# EAGLE schematic revA-voltlog-mod (EAGLE 9.6.2)

## Sheet 1 of 3
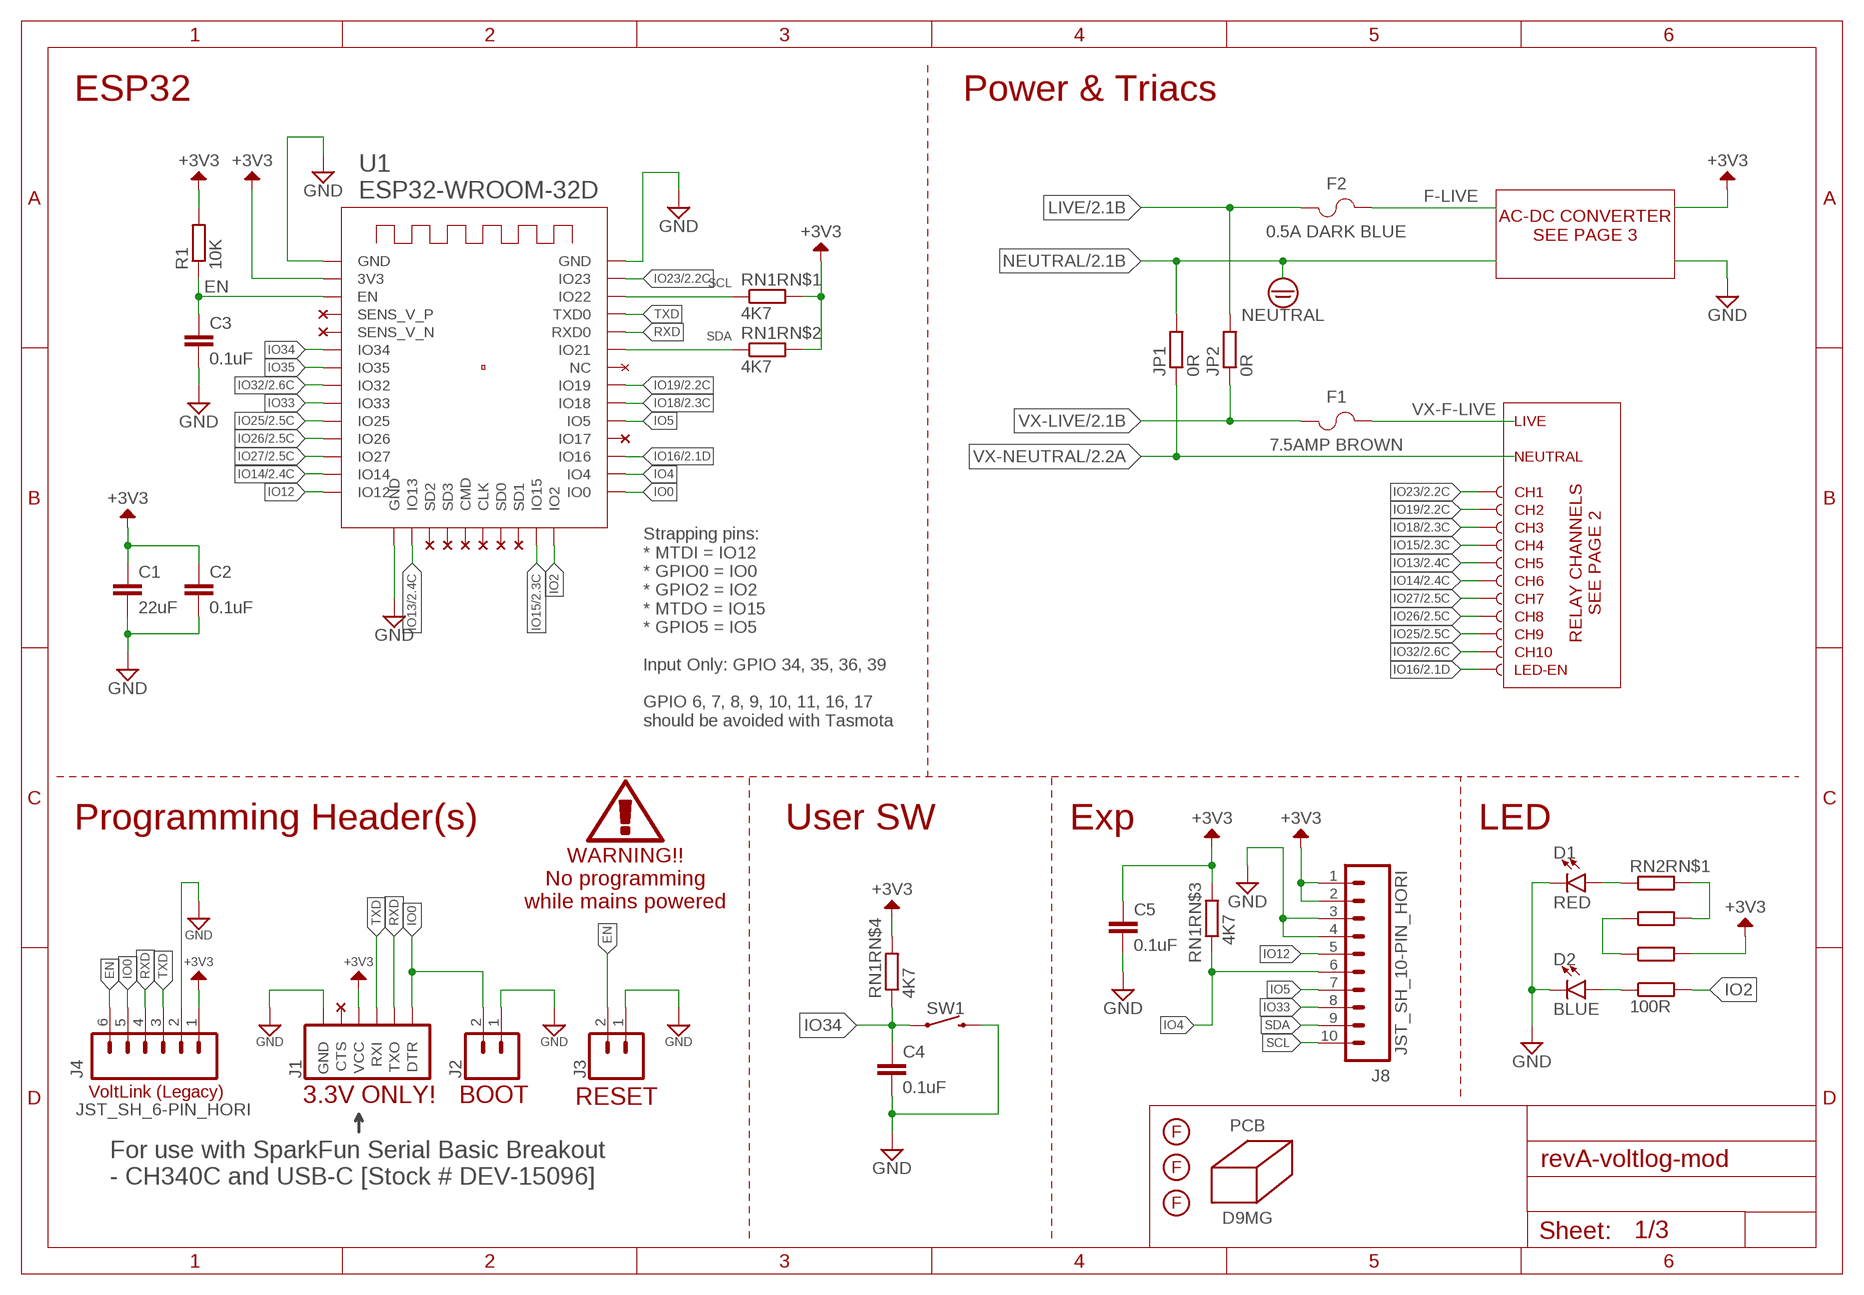
[diagram p0: schematic, sheet 1]

### Parts
C1  22uF  C-EUC0603  [C0603]
C2  0.1uF  C-EUC0603  [C0603]
C3  0.1uF  C-EUC0603  [C0603]
C4  0.1uF  C-EUC0603  [C0603]
C5  0.1uF  C-EUC0603  [C0603]
CH2  TEST-POINT3X4  [PAD.03X.04]
D1  RED  LED-RED-0805  [LED-0805]
D2  BLUE  LED-GREEN0805-PG  [LED-0805]
F1  7.5AMP BROWN  FUSEMINI-TH  [FUSE-MINI-THI]
F2  0.5A DARK BLUE  FUSEMINI-TH  [FUSE-MINI-THI]
IO13  TEST-POINT3X4  [PAD.03X.04]
J1  6_PIN_SERIAL_TARGETSILK  [6_PIN_SERIAL_TARGET_SIDE_W_SILK]
J2  CONN_02  [1X02]
J3  CONN_02  [1X02]
J4  JST_SH_6-PIN_HORI  [JST-SH-6-SMD-HORI-1.0MM]
J8  JST_SH_10-PIN_HORI  [JST-SH-10-SMD-HORI-1.0MM]
JP1  0R  R-EU_R1210  [R1210]
JP2  0R  R-EU_R1210  [R1210]
PCB  D9MG  [D9MG-160X90X50]
R1  10K  R-EU_R0603  [R0603]
RN1  4K7  R-EU-41206  [R1206X4]
RN2  100R  R-EU-41206  [R1206X4]
SW1  MOMENTARY-SWITCH-SPST-SMD-5.2-TALL-REDUNDANT  [TACTILE_SWITCH_SMD_5.2MM]
TP1  TEST-POINT3X4  [PAD.03X.04]
TP3  TEST-POINT3X4  [PAD.03X.04]
TP4  TEST-POINT3X4  [PAD.03X.04]
TP6  TEST-POINT3X4  [PAD.03X.04]
TP7  TEST-POINT3X4  [PAD.03X.04]
TP8  TEST-POINT3X4  [PAD.03X.04]
TP9  TEST-POINT3X4  [PAD.03X.04]
TP10  TEST-POINT3X4  [PAD.03X.04]
TP11  TEST-POINT3X4  [PAD.03X.04]
U1  ESP32-WROOM-32D  [ESP32-WROOM-32_EXP]
U$2  FIDUCIAL  [FIDUCIAL]
U$3  FIDUCIAL  [FIDUCIAL]
U$4  FIDUCIAL  [FIDUCIAL]

### Nets
+3V3: C1.1 C2.1 C5.1 J1.4(VCC) J4.1 J8.1 J8.2 R1.2 RN1.5 RN1.6 RN1.7 RN1.8 RN2.6 U1.2(3V3) ; also sheet 2,3
EN: C3.1 J3.2 J4.6 R1.1 U1.3(EN)
F-LIVE: F2.2@1 F2.2@2
GND: C1.2 C2.2 C3.2 C4.2 C5.2 D1.C D2.C J1.6(GND) J2.1 J3.1 J4.2 J8.3 J8.4 SW1.3 SW1.4 U1.1(GND) U1.15(GND) U1.38(GND) U1.39@1(GND) U1.39@2(GND) U1.39@3(GND) U1.39@4(GND) U1.39@5(GND) U1.39@6(GND) U1.39@7(GND) U1.39@8(GND) U1.39@9(GND) ; also sheet 2,3
IO0: J1.1(DTR) J2.2 J4.5 U1.25(IO0)
IO2: RN2.5 U1.24(IO2)
IO4: J8.6 RN1.3 U1.26(IO4)
IO5: J8.7 U1.29(IO5)
IO12: J8.5 U1.14(IO12)
IO13: IO13.1 U1.16(IO13) ; also sheet 2
IO14: TP6.1 U1.13(IO14) ; also sheet 2
IO15: TP4.1 U1.23(IO15) ; also sheet 2
IO16: TP11.1 U1.27(IO16) ; also sheet 2
IO18: TP3.1 U1.30(IO18) ; also sheet 2
IO19: CH2.1 U1.31(IO19) ; also sheet 2
IO23: TP1.1 U1.37(IO23) ; also sheet 2
IO25: TP9.1 U1.10(IO25) ; also sheet 2
IO26: TP8.1 U1.11(IO26) ; also sheet 2
IO27: TP7.1 U1.12(IO27) ; also sheet 2
IO32: TP10.1 U1.8(IO32) ; also sheet 2
IO33: J8.8 U1.9(IO33)
IO34: C4.1 RN1.4 SW1.1 SW1.2 U1.6(IO34)
IO35: U1.7(IO35)
LIVE: F2.1@1 F2.1@2 JP2.2 ; also sheet 2,3
N$27: RN2.2 RN2.3
N$28: D2.A RN2.4
N$29: RN2.7 RN2.8
N$30: D1.A RN2.1
NEUTRAL: JP1.2 ; also sheet 2,3
RXD: J1.2(TXO) J4.4 U1.34(RXD0)
SCL: J8.10 RN1.1 U1.36(IO22)
SDA: J8.9 RN1.2 U1.33(IO21)
TXD: J1.3(RXI) J4.3 U1.35(TXD0)
VX-F-LIVE: F1.2@1 F1.2@2 ; also sheet 2
VX-LIVE: F1.1@1 F1.1@2 JP2.1 ; also sheet 2
VX-NEUTRAL: JP1.1 ; also sheet 2
Unconnected: J1.5(CTS) J4.M@1(M) J4.M@2(M) J8.M@1(M) J8.M@2(M) U1.4(SENS_V_P) U1.5(SENS_V_N) U1.17(SD2) U1.18(SD3) U1.19(CMD) U1.20(CLK) U1.21(SD0) U1.22(SD1) U1.28(IO17) U1.32(NC)

### Notes on the sheet
- ESP32 | Power & Triacs
- AC-DC CONVERTER
  SEE PAGE 3
- LIVE
- NEUTRAL
- CH1
- CH2
- Strapping pins:
  * MTDI = IO12
  * GPIO0 = IO0
  * GPIO2 = IO2
  * MTDO = IO15
  * GPIO5 = IO5
  
  Input Only: GPIO 34, 35, 36, 39
  
  GPIO 6, 7, 8, 9, 10, 11, 16, 17
  should be avoided with Tasmota
- CH3
- CH4
- CH5
- RELAY CHANNELS
  SEE PAGE 2
- CH6
- CH7
- CH8
- CH9
- CH10
- LED-EN
- Programming Header(s) | User SW | Exp | LED
- WARNING!!
  No programming
  while mains powered
- VoltLink (Legacy) | 3.3V ONLY! | BOOT | RESET
- For use with SparkFun Serial Basic Breakout
  - CH340C and USB-C [Stock # DEV-15096]

## Sheet 2 of 3
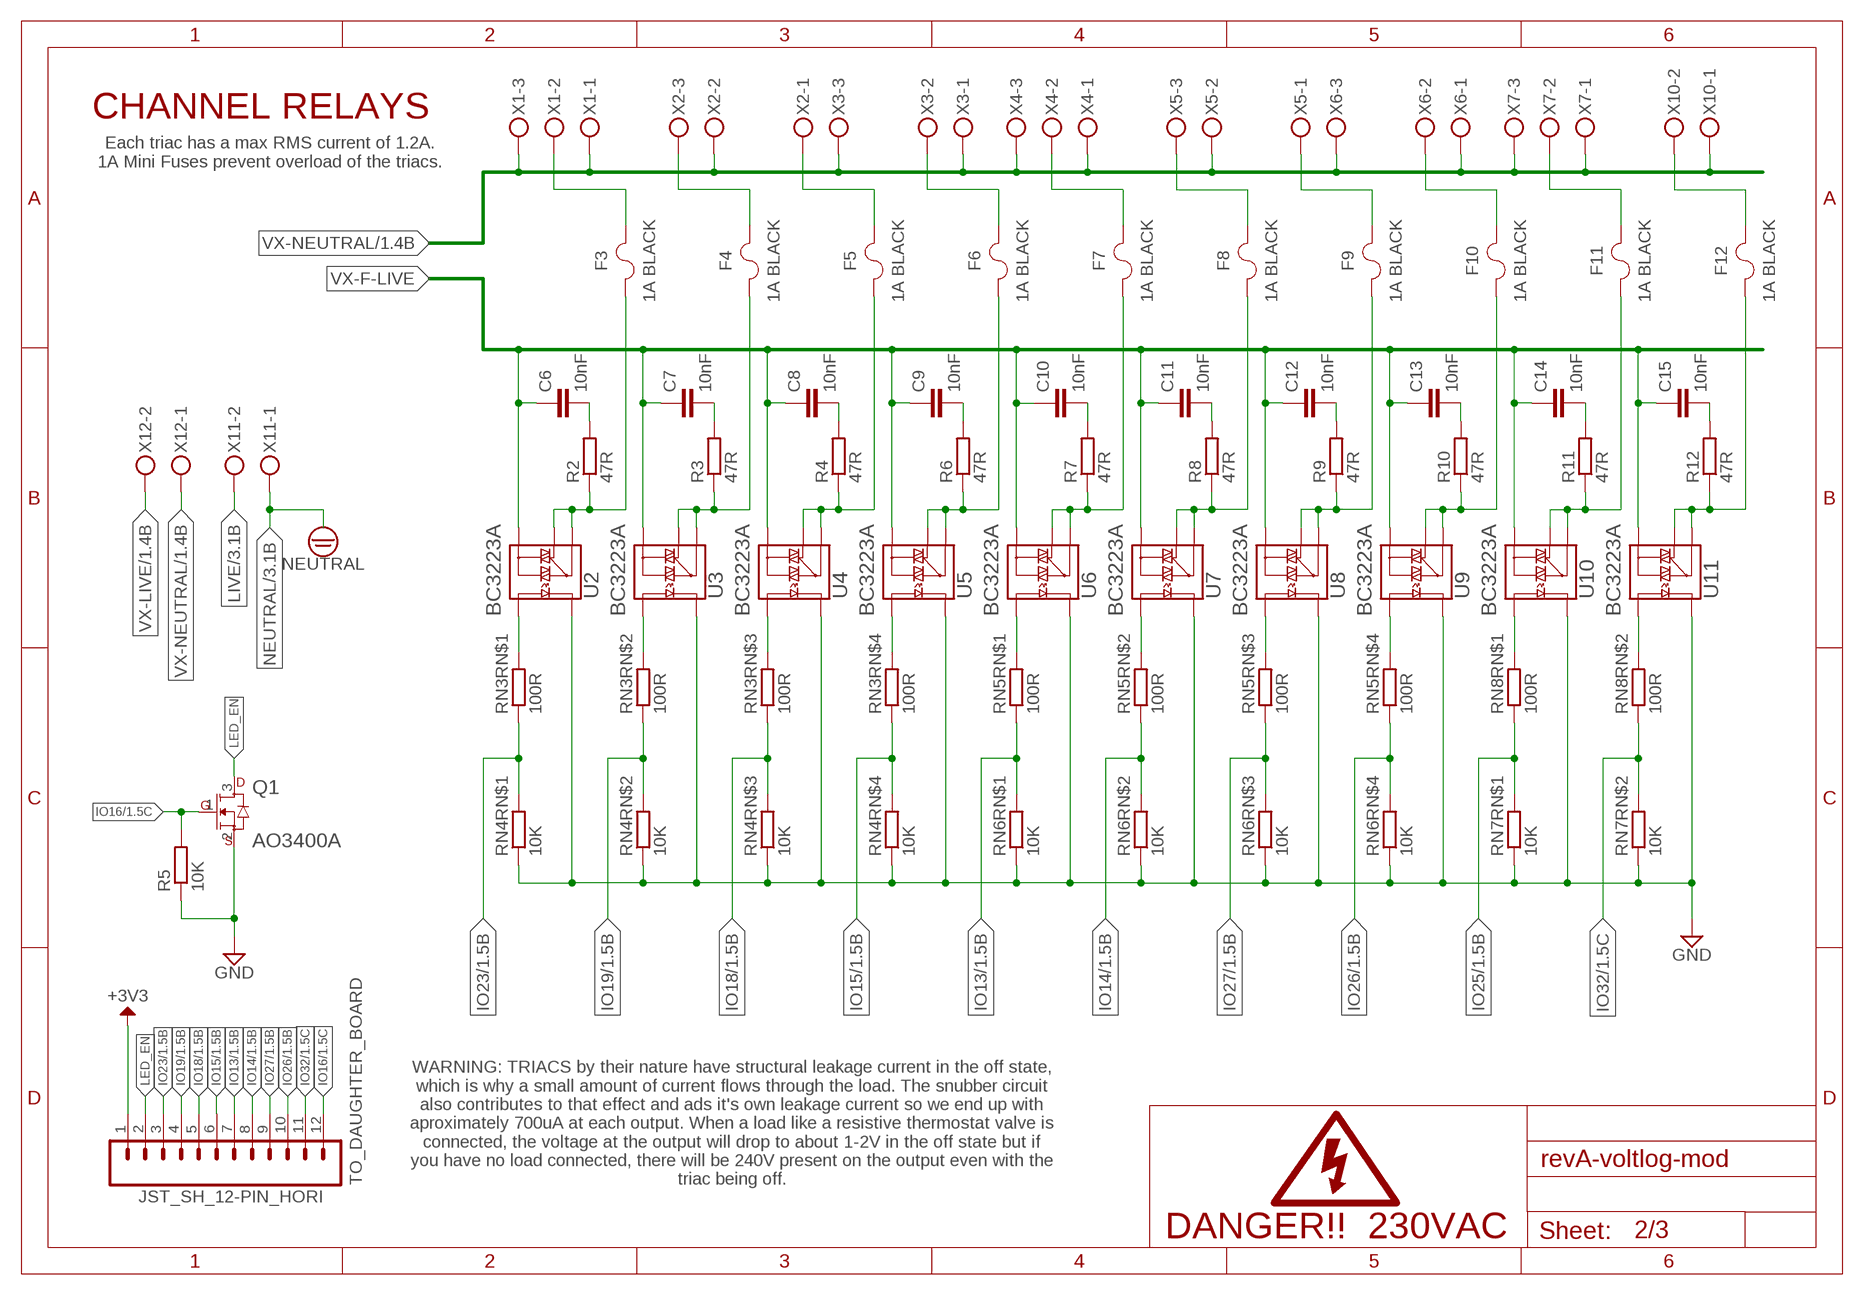
[diagram p1: schematic, sheet 2]

### Parts
C6  10nF  C-EU050-045X075  [C050-045X075]
C7  10nF  C-EU050-045X075  [C050-045X075]
C8  10nF  C-EU050-045X075  [C050-045X075]
C9  10nF  C-EU050-045X075  [C050-045X075]
C10  10nF  C-EU050-045X075  [C050-045X075]
C11  10nF  C-EU050-045X075  [C050-045X075]
C12  10nF  C-EU050-045X075  [C050-045X075]
C13  10nF  C-EU050-045X075  [C050-045X075]
C14  10nF  C-EU050-045X075  [C050-045X075]
C15  10nF  C-EU050-045X075  [C050-045X075]
F3  1A BLACK  FUSEMINI-TH  [FUSE-MINI-THI]
F4  1A BLACK  FUSEMINI-TH  [FUSE-MINI-THI]
F5  1A BLACK  FUSEMINI-TH  [FUSE-MINI-THI]
F6  1A BLACK  FUSEMINI-TH  [FUSE-MINI-THI]
F7  1A BLACK  FUSEMINI-TH  [FUSE-MINI-THI]
F8  1A BLACK  FUSEMINI-TH  [FUSE-MINI-THI]
F9  1A BLACK  FUSEMINI-TH  [FUSE-MINI-THI]
F10  1A BLACK  FUSEMINI-TH  [FUSE-MINI-THI]
F11  1A BLACK  FUSEMINI-TH  [FUSE-MINI-THI]
F12  1A BLACK  FUSEMINI-TH  [FUSE-MINI-THI]
Q1  AO3400A  [SOT-23-3L_AOS]
R2  47R  R-EU_R1206W  [R1206W]
R3  47R  R-EU_R1206W  [R1206W]
R4  47R  R-EU_R1206W  [R1206W]
R5  10K  R-EU_R0603  [R0603]
R6  47R  R-EU_R1206W  [R1206W]
R7  47R  R-EU_R1206W  [R1206W]
R8  47R  R-EU_R1206W  [R1206W]
R9  47R  R-EU_R1206W  [R1206W]
R10  47R  R-EU_R1206W  [R1206W]
R11  47R  R-EU_R1206W  [R1206W]
R12  47R  R-EU_R1206W  [R1206W]
RN3  100R  R-EU-41206  [R1206X4]
RN4  10K  R-EU-41206  [R1206X4]
RN5  100R  R-EU-41206  [R1206X4]
RN6  10K  R-EU-41206  [R1206X4]
RN7  10K  R-EU-41206  [R1206X4]
RN8  100R  R-EU-41206  [R1206X4]
TO_DAUGHTER_BOARD  JST_SH_12-PIN_HORI  [JST-SH-12-SMD-HORI-1.0MM]
U2  BC3223A  BCX2X3A  [7-PIN_DUAL-DIP-SMD]
U3  BC3223A  BCX2X3A  [7-PIN_DUAL-DIP-SMD]
U4  BC3223A  BCX2X3A  [7-PIN_DUAL-DIP-SMD]
U5  BC3223A  BCX2X3A  [7-PIN_DUAL-DIP-SMD]
U6  BC3223A  BCX2X3A  [7-PIN_DUAL-DIP-SMD]
U7  BC3223A  BCX2X3A  [7-PIN_DUAL-DIP-SMD]
U8  BC3223A  BCX2X3A  [7-PIN_DUAL-DIP-SMD]
U9  BC3223A  BCX2X3A  [7-PIN_DUAL-DIP-SMD]
U10  BC3223A  BCX2X3A  [7-PIN_DUAL-DIP-SMD]
U11  BC3223A  BCX2X3A  [7-PIN_DUAL-DIP-SMD]
X1  MKDSN1,5/3-5,08  [MKDSN1,5/3-5,08]
X2  MKDSN1,5/3-5,08  [MKDSN1,5/3-5,08]
X3  MKDSN1,5/3-5,08  [MKDSN1,5/3-5,08]
X4  MKDSN1,5/3-5,08  [MKDSN1,5/3-5,08]
X5  MKDSN1,5/3-5,08  [MKDSN1,5/3-5,08]
X6  MKDSN1,5/3-5,08  [MKDSN1,5/3-5,08]
X7  MKDSN1,5/3-5,08  [MKDSN1,5/3-5,08]
X10  MKDSN1,5/2-5,08  [MKDSN1,5/2-5,08]
X11  MKDSN1,5/2-5,08  [MKDSN1,5/2-5,08]
X12  MKDSN1,5/2-5,08  [MKDSN1,5/2-5,08]

### Nets
+3V3: TO_DAUGHTER_BOARD.1 ; also sheet 1,3
GND: Q1.2(S) R5.1 RN4.1 RN4.2 RN4.3 RN4.4 RN6.1 RN6.2 RN6.3 RN6.4 RN7.1 RN7.2 U2.1@1(C) U2.1@2(C) U2.3@1(C) U2.3@2(C) U2.4@1(C) U2.4@2(C) U3.1@1(C) U3.1@2(C) U3.3@1(C) U3.3@2(C) U3.4@1(C) U3.4@2(C) U4.1@1(C) U4.1@2(C) U4.3@1(C) U4.3@2(C) U4.4@1(C) U4.4@2(C) U5.1@1(C) U5.1@2(C) U5.3@1(C) U5.3@2(C) U5.4@1(C) U5.4@2(C) U6.1@1(C) U6.1@2(C) U6.3@1(C) U6.3@2(C) U6.4@1(C) U6.4@2(C) U7.1@1(C) U7.1@2(C) U7.3@1(C) U7.3@2(C) U7.4@1(C) U7.4@2(C) U8.1@1(C) U8.1@2(C) U8.3@1(C) U8.3@2(C) U8.4@1(C) U8.4@2(C) U9.1@1(C) U9.1@2(C) U9.3@1(C) U9.3@2(C) U9.4@1(C) U9.4@2(C) U10.1@1(C) U10.1@2(C) U10.3@1(C) U10.3@2(C) U10.4@1(C) U10.4@2(C) U11.1@1(C) U11.1@2(C) U11.3@1(C) U11.3@2(C) U11.4@1(C) U11.4@2(C) ; also sheet 1,3
IO13: RN5.1 RN6.8 TO_DAUGHTER_BOARD.7 ; also sheet 1
IO14: RN5.2 RN6.7 TO_DAUGHTER_BOARD.8 ; also sheet 1
IO15: RN3.4 RN4.5 TO_DAUGHTER_BOARD.6 ; also sheet 1
IO16: Q1.1(G) R5.2 TO_DAUGHTER_BOARD.12 ; also sheet 1
IO18: RN3.3 RN4.6 TO_DAUGHTER_BOARD.5 ; also sheet 1
IO19: RN3.2 RN4.7 TO_DAUGHTER_BOARD.4 ; also sheet 1
IO23: RN3.1 RN4.8 TO_DAUGHTER_BOARD.3 ; also sheet 1
IO25: RN7.8 RN8.1 ; also sheet 1
IO26: RN5.4 RN6.5 TO_DAUGHTER_BOARD.10 ; also sheet 1
IO27: RN5.3 RN6.6 TO_DAUGHTER_BOARD.9 ; also sheet 1
IO32: RN7.7 RN8.2 TO_DAUGHTER_BOARD.11 ; also sheet 1
LED_EN: Q1.3(D) TO_DAUGHTER_BOARD.2
LIVE: X11.2 ; also sheet 1,3
N$1: F3.1@1 F3.1@2 R2.1 U2.5@1(L3) U2.5@2(L3) U2.6@1(L2) U2.6@2(L2)
N$2: F4.1@1 F4.1@2 R3.1 U3.5@1(L3) U3.5@2(L3) U3.6@1(L2) U3.6@2(L2)
N$3: F6.1@1 F6.1@2 R6.1 U5.5@1(L3) U5.5@2(L3) U5.6@1(L2) U5.6@2(L2)
N$4: F5.1@1 F5.1@2 R4.1 U4.5@1(L3) U4.5@2(L3) U4.6@1(L2) U4.6@2(L2)
N$5: F7.1@1 F7.1@2 R7.1 U6.5@1(L3) U6.5@2(L3) U6.6@1(L2) U6.6@2(L2)
N$6: F8.1@1 F8.1@2 R8.1 U7.5@1(L3) U7.5@2(L3) U7.6@1(L2) U7.6@2(L2)
N$7: F9.1@1 F9.1@2 R9.1 U8.5@1(L3) U8.5@2(L3) U8.6@1(L2) U8.6@2(L2)
N$8: F11.1@1 F11.1@2 R11.1 U10.5@1(L3) U10.5@2(L3) U10.6@1(L2) U10.6@2(L2)
N$9: F10.1@1 F10.1@2 R10.1 U9.5@1(L3) U9.5@2(L3) U9.6@1(L2) U9.6@2(L2)
N$10: C6.2 R2.2
N$11: C7.2 R3.2
N$12: C8.2 R4.2
N$13: C9.2 R6.2
N$14: C10.2 R7.2
N$15: RN3.6 U4.2@1(A) U4.2@2(A)
N$17: C11.2 R8.2
N$18: RN3.5 U5.2@1(A) U5.2@2(A)
N$19: C12.2 R9.2
N$21: C13.2 R10.2
N$22: C14.2 R11.2
N$23: RN5.8 U6.2@1(A) U6.2@2(A)
N$24: F12.1@1 F12.1@2 R12.1 U11.5@1(L3) U11.5@2(L3) U11.6@1(L2) U11.6@2(L2)
N$25: C15.2 R12.2
N$26: RN8.7 U11.2@1(A) U11.2@2(A)
N$31: F3.2@1 F3.2@2 X1.2
N$32: F4.2@1 F4.2@2 X2.3
N$33: F5.2@1 F5.2@2 X2.1
N$34: F6.2@1 F6.2@2 X3.2
N$35: F7.2@1 F7.2@2 X4.2
N$36: F8.2@1 F8.2@2 X5.3
N$37: F9.2@1 F9.2@2 X5.1
N$38: F10.2@1 F10.2@2 X6.2
N$39: F11.2@1 F11.2@2 X7.2
N$40: F12.2@1 F12.2@2 X10.2
N$41: RN3.8 U2.2@1(A) U2.2@2(A)
N$43: RN3.7 U3.2@1(A) U3.2@2(A)
N$45: RN8.8 U10.2@1(A) U10.2@2(A)
N$46: RN5.5 U9.2@1(A) U9.2@2(A)
N$47: RN5.6 U8.2@1(A) U8.2@2(A)
N$48: RN5.7 U7.2@1(A) U7.2@2(A)
NEUTRAL: X11.1 ; also sheet 1,3
VX-F-LIVE: C6.1 C7.1 C8.1 C9.1 C10.1 C11.1 C12.1 C13.1 C14.1 C15.1 U2.8@1(L1) U2.8@2(L1) U3.8@1(L1) U3.8@2(L1) U4.8@1(L1) U4.8@2(L1) U5.8@1(L1) U5.8@2(L1) U6.8@1(L1) U6.8@2(L1) U7.8@1(L1) U7.8@2(L1) U8.8@1(L1) U8.8@2(L1) U9.8@1(L1) U9.8@2(L1) U10.8@1(L1) U10.8@2(L1) U11.8@1(L1) U11.8@2(L1) ; also sheet 1
VX-LIVE: X12.2 ; also sheet 1
VX-NEUTRAL: X1.1 X1.3 X2.2 X3.1 X3.3 X4.1 X4.3 X5.2 X6.1 X6.3 X7.1 X7.3 X10.1 X12.1 ; also sheet 1
Unconnected: RN7.3 RN7.4 RN7.5 RN7.6 RN8.3 RN8.4 RN8.5 RN8.6 TO_DAUGHTER_BOARD.M@1(M) TO_DAUGHTER_BOARD.M@2(M)

### Notes on the sheet
- CHANNEL RELAYS
- Each triac has a max RMS current of 1.2A.
  1A Mini Fuses prevent overload of the triacs.
- WARNING: TRIACS by their nature have structural leakage current in the off state,
  which is why a small amount of current flows through the load. The snubber circuit
  also contributes to that effect and ads it's own leakage current so we end up with
  aproximately 700uA at each output. When a load like a resistive thermostat valve is
  connected, the voltage at the output will drop to about 1-2V in the off state but if
  you have no load connected, there will be 240V present on the output even with the
  triac being off.
- DANGER!!  230VAC

## Sheet 3 of 3
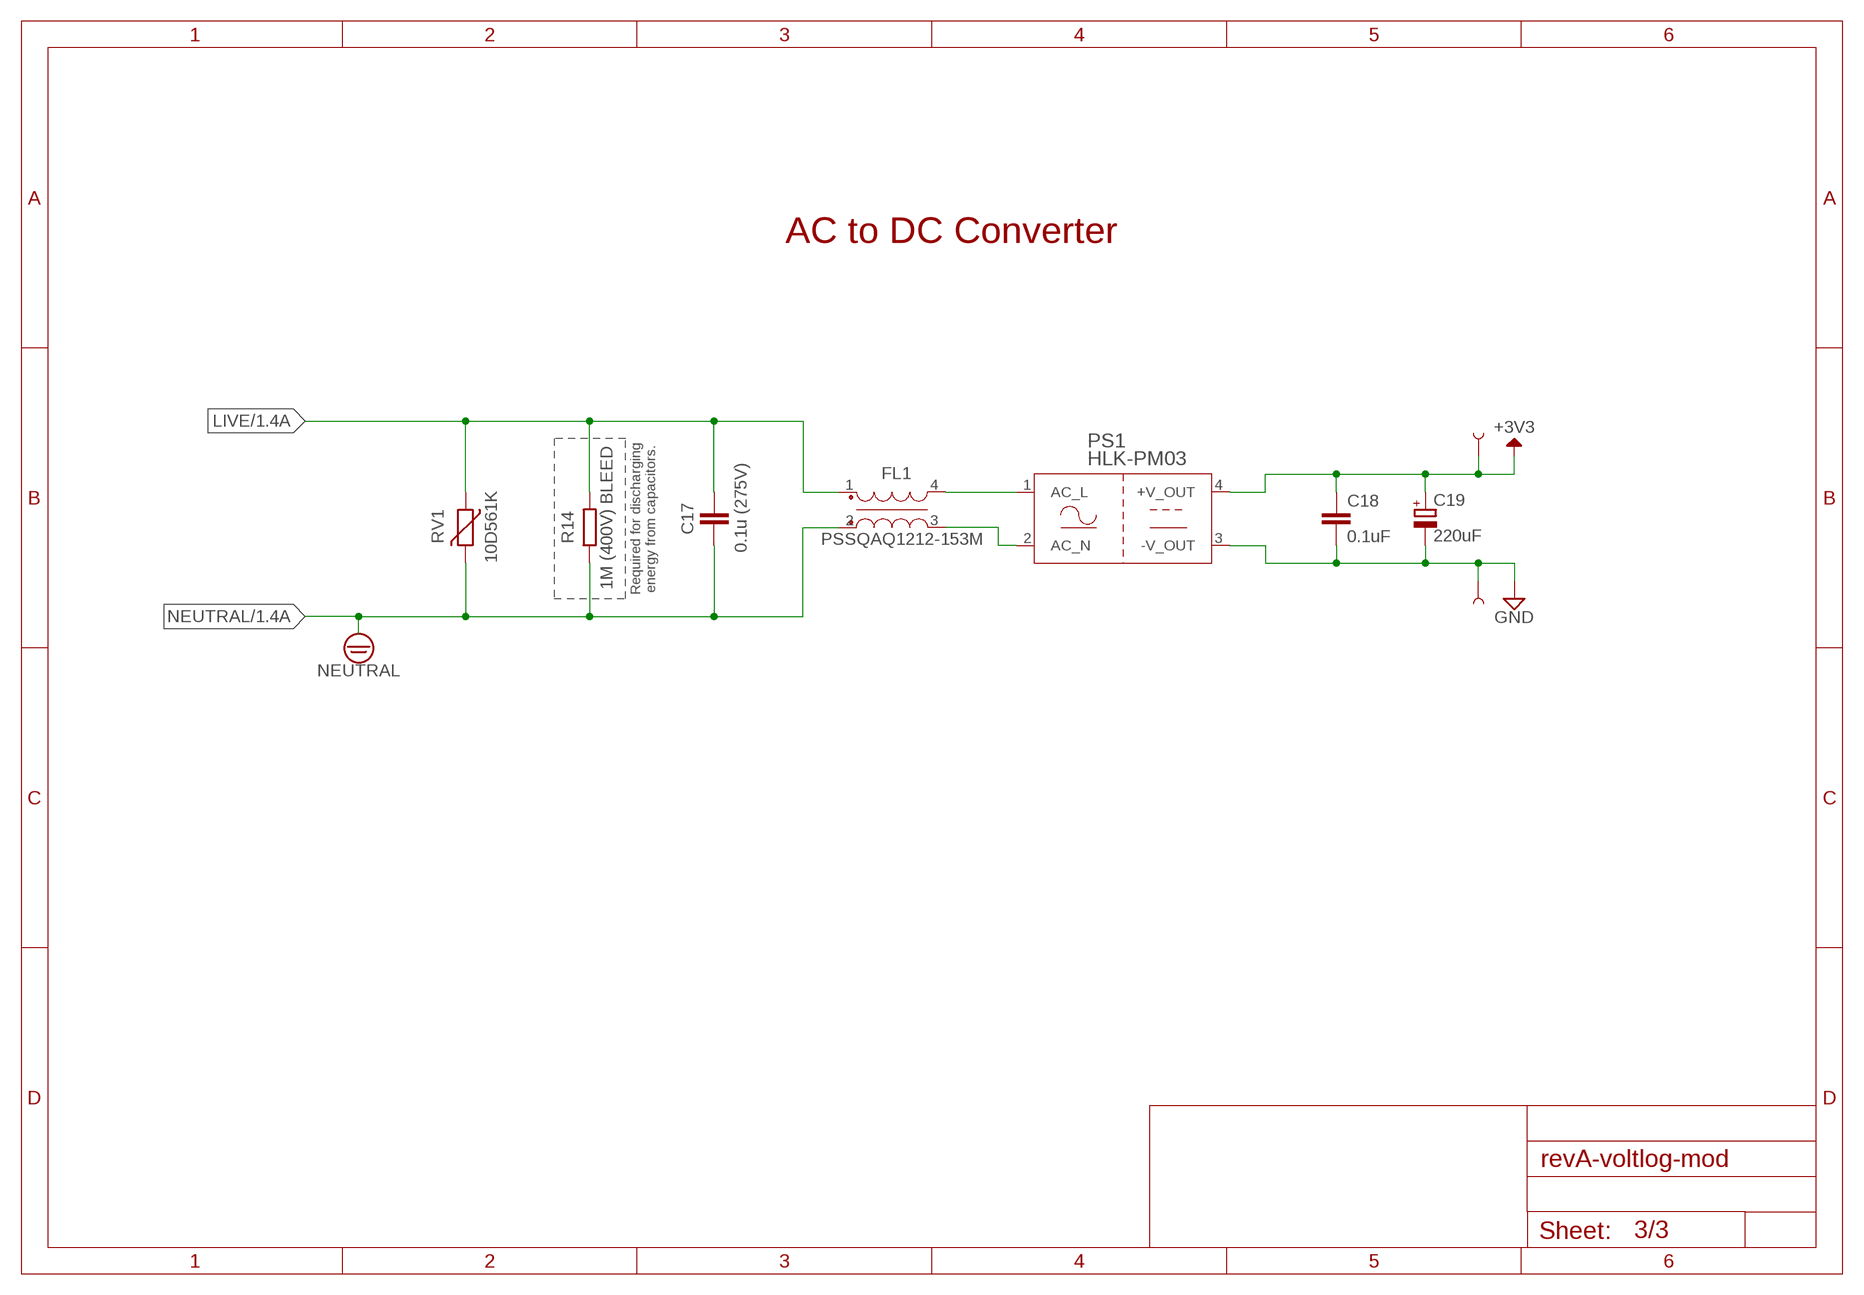
[diagram p2: schematic, sheet 3]

### Parts
C17  0.1u (275V)  C-EU075-063X106  [C075-063X106]
C18  0.1uF  C-EUC1206  [C1206]
C19  220uF  CPOL-EUUD-6,3X7,7  [UD-6,3X7,7_NICHICON]
FL1  PSSQAQ1212-153M  PSSQAQ1212  [CHOKE-SMD-20X17MM]
PS1  HLK-PM03  [DIP4_HLK-PM_HLK]
R14  1M (400V) BLEED  R-EU_R2010W  [R2010W]
RV1  10D561K  VARISTOR-7,5  [R-7,5]
TP2  TEST-POINT3X5  [PAD.03X.05]
TP5  TEST-POINT3X5  [PAD.03X.05]

### Nets
+3V3: C18.1 C19.+ PS1.4(+V_OUT) TP2.1 ; also sheet 1,2
GND: C18.2 C19.- PS1.3(-V_OUT) TP5.1 ; also sheet 1,2
LIVE: C17.2 FL1.1 R14.2 RV1.1 ; also sheet 1,2
N$16: FL1.4 PS1.1(AC_L)
N$20: FL1.3 PS1.2(AC_N)
NEUTRAL: C17.1 FL1.2 R14.1 RV1.2 ; also sheet 1,2

### Notes on the sheet
- AC to DC Converter
- Required for discharging
  energy from capacitors.

## Library data of the parts
C1-C15 C17 C18 = rcl:C-EU: CAPACITOR, European symbol; SPICEPREFIX: C
C19 = rcl:CPOL-EU: POLARIZED CAPACITOR, European symbol; SPICEPREFIX: C
CH2 IO13 TP1-TP11 = SparkFun-Connectors:TEST-POINT: SparkFun Test Points Bare copper test points for troubleshooting or In-Circuit-Testing. These are used by our Production team for verifying production board runs using pogo-pins on test beds. SparkFun Products: SparkFun LSM9DS1 Breakout <https://www.sparkfun.com/products/13284> SparkFun PSOC <https://www.sparkfun.com/products/13714> SparkFun Load Cell Amplifier <https://www.sparkfun.com/products/13879>
D1 = SparkFun-LED:LED-RED: Red SMD LED Used in manufacturing of most products at SparkFun Packages: 0603 - KB - KingBright (DIO-17976) SMD 0603 package [Datasheet] <https://www.kingbrightusa.com/images/catalog/SPEC/APT1608SURCK.pdf> 0603 - (DIO-00819, has gone EOL) SMD 0603 package 0603 SMART - SMD 0603 SMART package ( more efficient and expensive)[Product Link] <http://www.osram-os.com/Graphics/XPic2/00077099_0.pdf> 1206 - SMD1206 package [Product Link] <https://www.sparkfun.com/datasheets/DevTools/LilyPad/Q150OVS4.pdff> SparkFun Products: Pro Mini 328 -5V <https://www.sparkfun.com/products/821> RedBoard <https://www.sparkfun.com/products/12757> IOIO-OTG <https://www.sparkfun.com/products/13613>; PROD_ID: DIO-16865
D2 = SparkFun-LED:LED-GREEN: Green SMD LED Used in manufacturing of various products at SparkFun Packages: 0603 - SMD 0603 package [Product Link] <http://www.futureelectronics.com/en/technologies/semiconductors/optoelectronics/leds/Pages/9894312-LTST-C190GKT.aspx?CrossPart=HSMG-C190&IM=0> LilyPad 1206 - SMD1206 LilyPad package [Product Link] <http://www.futureelectronics.com/en/Technologies/Product.aspx?ProductID=IN150NGHARVATEKCORPORATION2049943&IM=0> 1206 - SMD1206 package [Product Link] <http://www.futureelectronics.com/en/technologies/semiconductors/optoelectronics/leds/Pages/8315665-LTST-C150KGKT.aspx?IM=0> 1206 Bottom Mount -SMD 1206 Bottom Mount [Product Link] <http://www.digikey.com/product-detail/en/lite-on-inc/LTST-C230KGKT/160-1456-1-ND/386854> SparkFun Products: Pro Mini 328 -5V <https://www.sparkfun.com/products/821> RedBoard <https://www.sparkfun.com/products/12757> MP3 Trigger <https://www.sparkfun.com/products/13720> Makey Makey <https://www.sparkfun.com/products/11076>
F1-F12 = amu-parts:FUSE
FL1 = untitled:PSSQAQ1212
J1 = SparkFun-Connectors:6_PIN_SERIAL_TARGET: 6-pin header connection for use with the "FTDI BASIC" pinout - TARGET SIDE. Also known as "Arduino Serial Program Header". It is used to mate with our FTDI Basic serial programmers using the Arduino IDE. Note, this device has "TARGET" in the name. It is intended to be used on a design that contains a target micro-controller that you wish to program. The "sister" device, named "CABLE" is inteneded to be used on a design that usually lives on the end of your USB cable and prvides the converter chip (FTDI232 or FTDI231x) to commnicate serial RX/TX. You can populate with some of these: Break Away Headers - Straight <https://www.sparkfun.com/products/116> (PRT-00116) For reference (or to suit your programming needs) check out these designs: SparkFun FTDI Basic Breakout - 5V <https://www.sparkfun.com/products/9716> (DEV-09716) SparkFun FTDI Basic Breakout - 3.3V <https://www.sparkfun.com/products/9873> (DEV-09873) SparkFun FTDI SmartBasic <https://www.sparkfun.com/products/12935> (DEV-12935) SparkFun Beefy 3 - FTDI Basic Breakout <https://www.sparkfun.com/products/13746> (DEV-13746)
J2 J3 = SparkFun-Connectors:CONN_02: Multi connection point. Often used as Generic Header-pin footprint for 0.1 inch spaced/style header connections On any of the 0.1 inch spaced packages, you can populate with these: Break Away Headers - Straight <https://www.sparkfun.com/products/116> (PRT-00116) Break Away Male Headers - Right Angle <https://www.sparkfun.com/products/553> (PRT-00553) Female Headers <https://www.sparkfun.com/products/115> (PRT-00115) Break Away Headers - Machine Pin <https://www.sparkfun.com/products/117> (PRT-00117) Break Away Female Headers - Swiss Machine Pin <https://www.sparkfun.com/products/743> (PRT-00743) For SCREWTERMINALS and SPRING TERMINALS visit here: Screw Terimnals on SparkFun.com <https://www.sparkfun.com/search/results?term=Screw+Terminals> (5mm/3.5mm/2.54mm spacing) This device is also useful as a general connection point to wire up your design to another part of your project. Our various solder wires solder well into these plated through hole pads. Hook-Up Wire - Assortment (Stranded, 22 AWG) <https://www.sparkfun.com/products/11375> (PRT-11375) Hook-Up Wire - Assortment (Solid Core, 22 AWG) <https://www.sparkfun.com/products/11367> (PRT-11367) View the entire wire category on our website here <https://www.sparkfun.com/categories/141> Special notes: Molex polarized connector foot print use with: PRT-08233 with associated crimp pins and housings. 2.54_SCREWTERM for use with PRT-10571. 3.5mm Screw Terminal footprints for PRT-08084 5mm Screw Terminal footprints for use with PRT-08432
J4 = untitled:JST_SH_6-PIN_HORI
J8 = tecsmith-jst:JST_SH_10-PIN_HORI
JP1 JP2 R1-R12 R14 = rcl:R-EU_: RESISTOR, European symbol; SPICEPREFIX: R
PCB = tecsmith_ali_plastic_enclosures:D9MG
PS1 = amu-parts:HLK-PM03; MANUFACTURER_PART_NUMBER: HLK-PM03; MFR_NAME: Hi-Link
Q1 = untitled:AO3400A
RN1-RN8 = tecsmith_keyboards:R-EU-4
RV1 = varistor:VARISTOR: VARISTOR
SW1 = SparkFun-Switches:MOMENTARY-SWITCH-SPST: Momentary Switch (Pushbutton) - SPST Normally-open (NO) SPST momentary switches (buttons, pushbuttons). Variants PTH-12MM - 12mm square, through-hole Momentary Pushbutton Switch - 12mm Square <https://www.sparkfun.com/products/9190> (COM-09190) PTH-6.0MM, PTH-6.0MM-KIT - 6.0mm square, through-hole Mini Pushbutton Switch <https://www.sparkfun.com/products/97> (COM-00097) KIT package intended for soldering kit's - only one side of pads' copper is exposed. PTH-RIGHT-ANGLE-KIT - Right-angle, through-hole Right Angle Tactile Button <https://www.sparkfun.com/products/10791> - Used on SparkFun BigTime Watch Kit <https://www.sparkfun.com/products/11734> SMD-12MM - 12mm square, surface-mount Tactile Button - SMD (12mm) <https://www.sparkfun.com/products/12993> (COM-12993) Used on SparkFun PicoBoard <https://www.sparkfun.com/products/11888> SMD-4.5MM - 4.5mm Square Trackball Switch Used on SparkFun Blackberry Trackballer Breakout <https://www.sparkfun.com/products/13169> SMD-4.6MMX2.8MM - 4.60mm x 2.80mm, surface mount Used on SparkFun Pro Micro - RP2040 <https://www.sparkfun.com/products/17717> SMD-5.2MM, SMD-5.2-REDUNDANT - 5.2mm square, surface-mount Mini Pushbutton Switch - SMD <https://www.sparkfun.com/products/8720> (COM-08720) Used on Arduino Pro Mini <https://www.sparkfun.com/products/11114> REDUNDANT package connects both switch circuits together SMD-6.0X3.5MM - 6.0 x 3.5mm, surface mount Momentary Reset Switch SMD <https://www.sparkfun.com/products/8229> (COM-08229) SMD-6.2MM-TALL - 6.2mm square, surface mount Tactile Button - SMD (6mm) <https://www.sparkfun.com/products/12992> Used on SparkFun Digital Sandbox <https://www.sparkfun.com/products/12651> SMD-RIGHT-ANGLE - Right-angle, surface mount Used on SparkFun Block for Intel® Edison - Arduino <https://www.sparkfun.com/products/13036>; PROD_ID: SWCH-14139
TO_DAUGHTER_BOARD = tecsmith-jst:JST_SH_12-PIN_HORI
U1 = tecsmith-esp32:ESP32-WROOM-32D
U2-U11 = amu-parts:BCX2X3A
U$2-U$4 = tecsmith_custom_nick_nacks:FIDUCIAL
X1-X7 = con-phoenix-508:MKDSN1,5/3-5,08: MKDSN 1,5/ 3-5,08 Printklemme Nennstrom: 13,5 A Nennspannung: 250 V Rastermaß: 5,08 mm Polzahl: 3 Anschlussart: Schraubanschluss Montage: Löten Anschlussrichtung Leiter/Platine: 0 ° Artikelnummer: 1729131 Source: http://eshop.phoenixcontact.com .. 1729131.pdf
X10-X12 = con-phoenix-508:MKDSN1,5/2-5,08: MKDSN 1,5/ 2-5,08 Printklemme Nennstrom: 13,5 A Nennspannung: 250 V Rastermaß: 5,08 mm Polzahl: 2 Anschlussart: Schraubanschluss Montage: Löten Anschlussrichtung Leiter/Platine: 0 ° Artikelnummer: 1729128 Source: http://eshop.phoenixcontact.com .. 1729128.pdf